# EAGLE design pic32mx170_tqfp44_breakout (EAGLE 7.2.0)
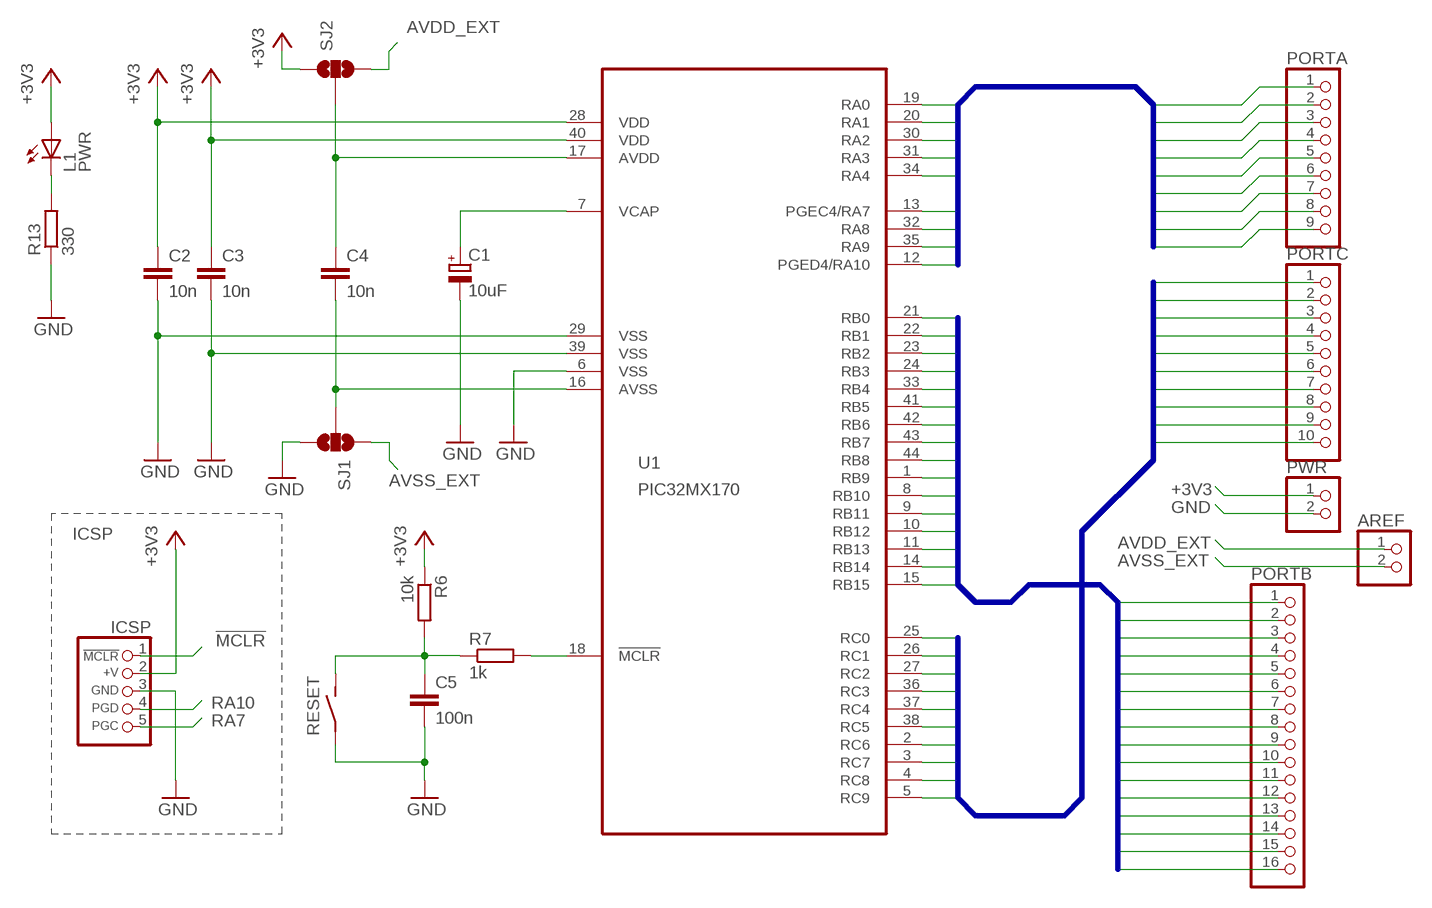
[diagram p0: schematic, sheet 1]

## Parts
AREF  PINHD-1X2  [1X02]
C1  10uF  CPOL-EUSMCA  [SMC_A]
C2  10n  C-EUC0805  [C0805]
C3  10n  C-EUC0805  [C0805]
C4  10n  C-EUC0805  [C0805]
C5  100n  C-EUC0805  [C0805]
ICSP  CON_HEADER_PRG_PIC_ICSPB  [HEADER_PRG_1X05_ICSP_B]
L1  PWR  LED-0805  [LED-805]
PORTA  PINHD-1X9  [1X09]
PORTB  PINHD-1X16  [1X16]
PORTC  PINHD-1X10  [1X10]
PWR  PINHD-1X2  [1X02]
R6  10k  R-EU_R0805  [R0805]
R7  1k  R-EU_R0805  [R0805]
R13  330  R-EU_R0805  [R0805]
RESET  ITT-PTS645S  [ITT-PTS645S]
SJ1  SOLDERJUMPER_2WAYS  [SJ_3]
SJ2  SOLDERJUMPER_2WAYS  [SJ_3]
U1  PIC32MX170  PIC32MX170FXXXD  [TQFP44]

## Nets
!MCLR: ICSP.1(/MCLR) R7.2 U1.18(!MCLR)
+3V3: C2.1 C3.1 ICSP.2(+V) L1.A PWR.1 R6.1 SJ2.1 U1.28(VDD) U1.40(VDD)
AVDD: C4.1 SJ2.2 U1.17(AVDD)
AVDD_EXT: AREF.1 SJ2.3
AVSS: C4.2 SJ1.2 U1.16(AVSS)
AVSS_EXT: AREF.2 SJ1.1
GND: C1.- C2.2 C3.2 C5.2 ICSP.3(GND) PWR.2 R13.1 RESET.P$1 RESET.P$2 SJ1.3 U1.6(VSS) U1.29(VSS) U1.39(VSS)
N$2: C1.+ U1.7(VCAP)
N$26: L1.C R13.2
RA0: PORTA.1 U1.19(RA0)
RA1: PORTA.2 U1.20(RA1)
RA2: PORTA.3 U1.30(RA2)
RA3: PORTA.4 U1.31(RA3)
RA4: PORTA.5 U1.34(RA4)
RA7: ICSP.5(PGC) PORTA.6 U1.13(PGEC4/RA7)
RA8: PORTA.7 U1.32(RA8)
RA9: PORTA.8 U1.35(RA9)
RA10: ICSP.4(PGD) PORTA.9 U1.12(PGED4/RA10)
RB0: PORTB.1 U1.21(RB0)
RB1: PORTB.2 U1.22(RB1)
RB2: PORTB.3 U1.23(RB2)
RB3: PORTB.4 U1.24(RB3)
RB4: PORTB.5 U1.33(RB4)
RB5: PORTB.6 U1.41(RB5)
RB6: PORTB.7 U1.42(RB6)
RB7: PORTB.8 U1.43(RB7)
RB8: PORTB.9 U1.44(RB8)
RB9: PORTB.10 U1.1(RB9)
RB10: PORTB.11 U1.8(RB10)
RB11: PORTB.12 U1.9(RB11)
RB12: PORTB.13 U1.10(RB12)
RB13: PORTB.14 U1.11(RB13)
RB14: PORTB.15 U1.14(RB14)
RB15: PORTB.16 U1.15(RB15)
RC0: PORTC.1 U1.25(RC0)
RC1: PORTC.2 U1.26(RC1)
RC2: PORTC.3 U1.27(RC2)
RC3: PORTC.4 U1.36(RC3)
RC4: PORTC.5 U1.37(RC4)
RC5: PORTC.6 U1.38(RC5)
RC6: PORTC.7 U1.2(RC6)
RC7: PORTC.8 U1.3(RC7)
RC8: PORTC.9 U1.4(RC8)
RC9: PORTC.10 U1.5(RC9)
RESET: C5.1 R6.2 R7.1 RESET.P$3 RESET.P$4

## Buses
RA[0..4],RA[7..10]
RB[0..15]
RC[0..9]

## Notes on the sheet
- ICSP

## Library data of the parts
AREF PWR = pinhead:PINHD-1X2: PIN HEADER
C1 = rcl:CPOL-EU: POLARIZED CAPACITOR, European symbol
C2-C5 = resistor:C-EU: CAPACITOR, European symbol
ICSP = dp_devices:CON_HEADER_PRG_PIC_ICSP: 5-pin PIC In Circuit Serial Programming header
L1 = dp_devices:LED: Light Emitting Diode
PORTA = pinhead:PINHD-1X9: PIN HEADER
PORTB = pinhead:PINHD-1X16: PIN HEADER
PORTC = pinhead:PINHD-1X10: PIN HEADER
R6 R7 = resistor:R-EU_: RESISTOR, European symbol
R13 = rcl:R-EU_: RESISTOR, European symbol
RESET = Catmacey:ITT-PTS645: ITT SWITCH
SJ1 SJ2 = SparkFun:SOLDERJUMPER_2WAY: Solder Jumper 2 way solder jumper
U1 = Catmacey:PIC32MX170FXXXD

## Board
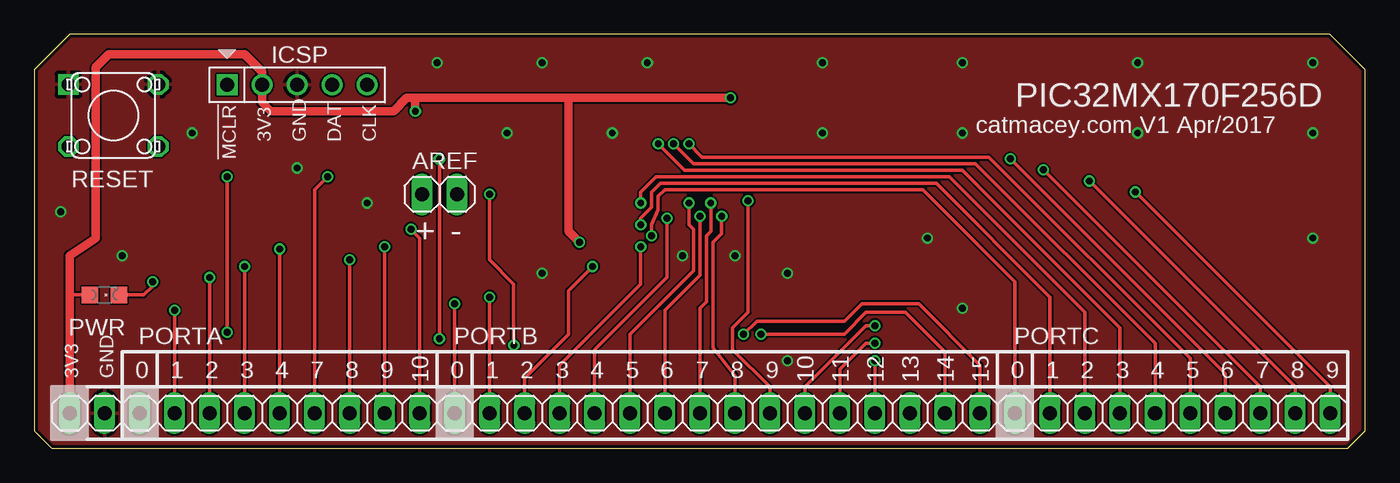
[diagram p1: board, top side]
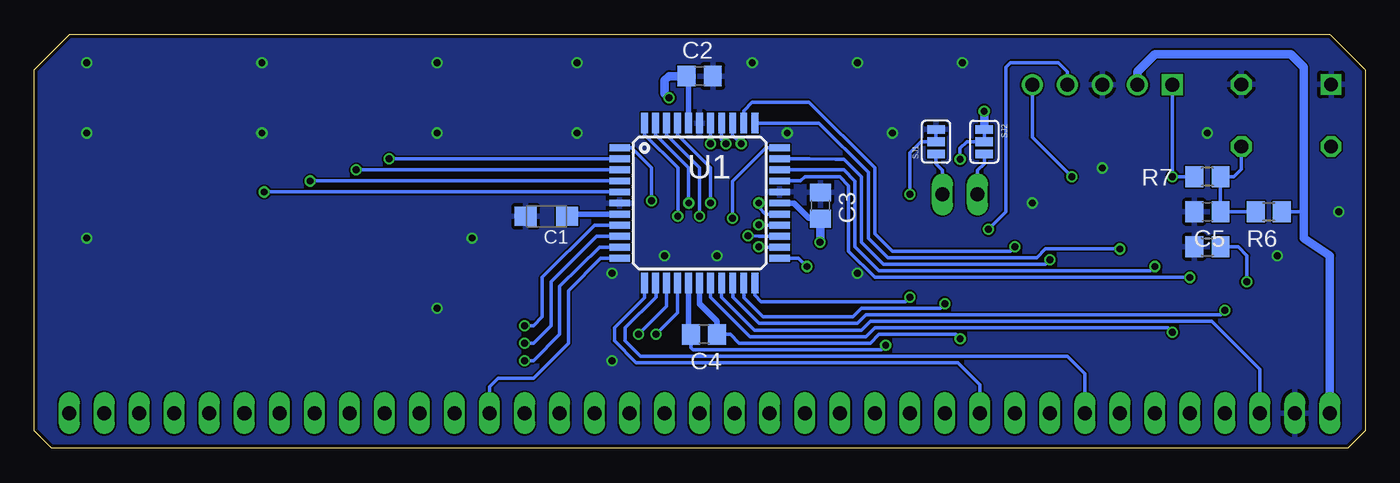
[diagram p2: board, bottom side, seen from below]

Size 96.51 x 30 mm. Coordinates in mm from the lower left corner, seen from the top.
Outline: 96.51,1.27 96.51,27.46 93.97,30 2.54,30 0,27.46 0,1.27 1.27,0 95.24,0 96.51,1.27
Copper layers (1*16): Top 0.035mm / dielectric 1.5mm / Bottom 0.035mm
Design rules "dirt_cheap_dirty_boards.v1": minimum track width 5mil, minimum drill 12mil, track to track 5mil, track to pad 5mil, pad to pad 5mil, via to via 5mil, smd to smd 0mil, copper to edge 10mil, drill to drill 10mil, minimum pad ring 10mil, minimum via ring 6mil, stop-mask expansion 2mil, vias tented up to drill 25mil, thermal gap 10mil

### Footprints (pad centres in the part's own frame; a part is rotated, then mirrored left to right if it is on the bottom)
1X02 = drill 1.016 long: 1 -1.27,0; 2 1.27,0
SMC_A = smd 1.6 x 1.4: + -1.5,0; - 1.5,0
C0805 = smd 1.3 x 1.5: 1 -0.95,0; 2 0.95,0
HEADER_PRG_1X05_ICSP_B = drill 1.016 square: 1 -5.08,0 | drill 1.016: 2 -2.54,0; 3 0,0; 4 2.54,0; 5 5.08,0
LED-805 = smd 1.2 x 1.2: A 0,-1.05; C 0,1.05
1X09 = drill 1.016 long: 1 -10.16,0; 2 -7.62,0; 3 -5.08,0; 4 -2.54,0; 5 0,0; 6 2.54,0; 7 5.08,0; 8 7.62,0; 9 10.16,0
1X16 = drill 1.016 long: 1 -19.05,0; 2 -16.51,0; 3 -13.97,0; 4 -11.43,0; 5 -8.89,0; 6 -6.35,0; 7 -3.81,0; 8 -1.27,0; 9 1.27,0; 10 3.81,0; 11 6.35,0; 12 8.89,0; 13 11.43,0; 14 13.97,0; 15 16.51,0; 16 19.05,0
1X10 = drill 1.016 long: 1 -11.43,0; 2 -8.89,0; 3 -6.35,0; 4 -3.81,0; 5 -1.27,0; 6 1.27,0; 7 3.81,0; 8 6.35,0; 9 8.89,0; 10 11.43,0
R0805 = smd 1.3 x 1.5: 1 -0.95,0; 2 0.95,0
ITT-PTS645S = drill 1 square: P$1 -3.25,2.25 | drill 1 octagon: P$2 3.25,2.25; P$3 -3.25,-2.25; P$4 3.25,-2.25
SJ_3 = smd 0.635 x 1.27: 1 -0.889,0; 2 0,0; 3 0.889,0
TQFP44 = smd 1.5 x 0.5: 1 -5.8,4; 2 -5.8,3.2; 3 -5.8,2.4; 4 -5.8,1.6; 5 -5.8,0.8; 6 -5.8,0; 7 -5.8,-0.8; 8 -5.8,-1.6; 9 -5.8,-2.4; 10 -5.8,-3.2; 11 -5.8,-4; 23 5.8,-4; 24 5.8,-3.2; 25 5.8,-2.4; 26 5.8,-1.6; 27 5.8,-0.8; 28 5.8,0; 29 5.8,0.8; 30 5.8,1.6; 31 5.8,2.4; 32 5.8,3.2; 33 5.8,4 | smd 0.5 x 1.5: 12 -4,-5.8; 13 -3.2,-5.8; 14 -2.4,-5.8; 15 -1.6,-5.8; 16 -0.8,-5.8; 17 0,-5.8; 18 0.8,-5.8; 19 1.6,-5.8; 20 2.4,-5.8; 21 3.2,-5.8; 22 4,-5.8; 34 4,5.8; 35 3.2,5.8; 36 2.4,5.8; 37 1.6,5.8; 38 0.8,5.8; 39 0,5.8; 40 -0.8,5.8; 41 -1.6,5.8; 42 -2.4,5.8; 43 -3.2,5.8; 44 -4,5.8

### Placement (x,y rotation side)
AREF  29.37,18.41 0 top
C1  59.37,16.83 180 bottom
C2  48.26,26.99 0 bottom
C3  39.5,17.59 90 bottom
C4  47.94,8.26 180 bottom
C5  11.43,17.14 180 bottom
ICSP  19.05,26.35 0 top
L1  5.08,11.11 270 top
PORTA  17.78,2.54 0 top
PORTB  49.53,2.54 0 top
PORTC  82.55,2.54 0 top
PWR  3.81,2.54 0 top
R6  6.99,17.14 180 bottom
R7  11.43,19.68 180 bottom
R13  11.43,14.61 0 bottom
RESET  5.71,24.13 0 top
SJ1  31.11,22.23 90 bottom
SJ2  27.62,22.23 270 bottom
U1  48.26,17.78 0 bottom

### Tracks (layer width: path | path; a pad name or v marks a point on that pad's centre or on a via)
!MCLR  (via drill 0.5)
  Top 0.254: v13.97,19.68 v13.97,8.41
  Bottom 0.254: U1.18 47.46,10.95 44.61,8.1 36.2,8.1 35.56,8.73 14.29,8.73 v13.97,8.41 | ICSP.1 v13.97,19.68 R7.2
+3V3  (via drill 0.5)
  Top 0.254: L1.A 2.54,11.11 2.54,10.79
  Top 0.61: 27.62,25.4 26.99,25.4 26.04,24.45 17.14,24.45 16.51,25.08 ICSP.2 16.51,27.3 15.24,28.57 5.4,28.57 4.45,27.62 4.45,15.24 2.54,13.97 2.54,10.79 PWR.1 | 27.62,25.4 38.73,25.4 | 38.73,25.4 v50.48,25.4 | v39.53,14.92 38.73,15.72 38.73,25.4 | v27.62,24.45 27.62,25.4
  Bottom 0.254: C2.1 49.06,26.84 | R6.1 4.45,17.14
  Bottom 0.406: 49.06,26.84 U1.40 | C3.1 39.53,16.67 40.32,16.67 41.43,17.78 U1.28
  Bottom 0.61: PWR.1 2.54,13.97 4.45,15.24 4.45,17.14 4.45,27.62 5.4,28.57 15.24,28.57 16.51,27.3 ICSP.2 | v50.48,25.4 50.8,25.72 50.8,26.67 50.48,26.99 C2.1 | v39.53,14.92 39.5,14.95 C3.1 | SJ2.1 v27.62,24.45
AVDD  (via drill 0.5)
  Top 0.254: v29.37,7.94 v29.37,20.95
  Bottom 0.254: C4.1 46.99,8.1 C4.1 46.04,8.26 45.4,7.62 35.88,7.62 35.24,8.26 29.69,8.26 v29.37,7.94 | v29.37,20.95 29.37,21.75 28.89,22.23 SJ2.2 27.62,22.86
  Bottom 0.406: U1.17 48.26,10.48 46.99,9.21 C4.1
AVDD_EXT
  Bottom 0.254: SJ2.3 27.62,20.64 28.1,20.16 AREF.1
AVSS  (via drill 0.5)
  Top 0.254: v34.77,7.46 34.77,11.91 33.02,13.65 v33.02,18.41
  Bottom 0.254: 49.06,8.88 C4.2 48.89,7.3 48.74,7.14 35.08,7.14 v34.77,7.46 | v33.02,18.41 33.02,21.43 32.23,22.23 SJ1.2 31.11,22.86
  Bottom 0.406: 49.06,8.88 49.05,9.36 49.05,10.16 U1.16
AVSS_EXT
  Bottom 0.254: SJ1.1 31.11,20.64 30.64,20.16 AREF.2
GND  (via drill 0.5)
  other vias: 64.77,15.24 46.99,13.97 57.15,22.86 67.31,22.86 80.01,22.86 1.9,17.14 19.05,20.32 11.43,22.86 34.29,22.86 29.21,27.94 36.83,27.94 44.45,27.94 24.13,17.78 36.83,12.7 41.91,22.86 54.61,6.35 92.71,22.86 92.71,27.94 92.71,15.24 80.01,27.94 67.31,27.94 57.15,27.94 50.8,13.97 54.61,12.7 67.31,10.16 6.35,13.97
  pour Bottom: -1.27,30.48 99.06,30.48 99.06,0 -1.27,0
  pour Top: -1.27,30.16 98.74,30.16 98.74,0 -1.27,0
N$2
  Bottom 0.254: C1.+ 57.72,16.98
  Bottom 0.406: 57.72,16.98 U1.7
N$26  (via drill 0.5)
  Top 0.254: L1.C 7.94,11.11 8.57,11.75 v8.57,12.06
  Bottom 0.254: v8.57,12.06 8.57,13.97 9.21,14.61 R13.2
RA0
  Bottom 0.254: U1.19 46.66,10.94 44.29,8.57 36.51,8.57 35.88,9.21 11.11,9.21 7.62,5.71 PORTA.1
RA1  (via drill 0.5)
  Top 0.254: PORTA.2 v10.16,10
  Bottom 0.254: U1.20 45.86,10.94 43.97,9.05 36.83,9.05 36.2,9.68 10.48,9.68 v10.16,10
RA2  (via drill 0.5)
  Top 0.254: PORTA.3 v12.7,12.38
  Bottom 0.254: v12.7,12.38 35.56,12.38 37.46,14.29 37.46,19.05 38.1,19.68 40.64,19.68 40.95,19.38 U1.30
RA3  (via drill 0.5)
  Top 0.254: PORTA.4 v15.24,13.18
  Bottom 0.254: v15.24,13.18 15.56,12.86 35.24,12.86 36.99,14.61 36.99,19.37 37.8,20.18 U1.31
RA4  (via drill 0.5)
  Top 0.254: PORTA.5 v17.78,14.45
  Bottom 0.254: v17.78,14.45 23.18,14.45 23.81,13.81 34.61,13.81 36.04,15.24 36.04,20 39.61,23.58 U1.34
RA7  (via drill 0.5)
  Top 0.254: v21.27,19.68 20.32,18.73 PORTA.6
  Bottom 0.254: U1.13 51.43,11.96 51.43,10.95 53.66,8.73 53.66,7.78 52.55,6.67 21.59,6.67 20.32,5.4 PORTA.6 | ICSP.5 24.13,22.54 v21.27,19.68
RA8  (via drill 0.5)
  Top 0.254: PORTA.7 v22.86,13.65
  Bottom 0.254: v22.86,13.65 23.18,13.34 34.92,13.34 36.51,14.92 36.51,19.68 37.78,20.95 38.42,20.95 40.3,20.98 U1.32
RA9  (via drill 0.5)
  Top 0.254: PORTA.8 v25.4,14.61
  Bottom 0.254: v25.4,14.61 25.72,14.29 34.29,14.29 35.56,15.56 35.56,20.32 40.32,25.08 44.45,25.08 45.06,24.47 U1.35
RA10  (via drill 0.5)
  Top 0.254: v27.3,15.88 27.94,15.24 PORTA.9
  Bottom 0.254: U1.12 52.26,10.92 54.45,8.73 54.45,7.78 52.86,6.19 29.53,6.19 27.94,4.6 PORTA.9 | ICSP.4 21.59,27.3 22.23,27.94 25.72,27.94 26.04,27.62 26.04,17.14 v27.3,15.88
RB0  (via drill 0.5)
  Top 0.254: PORTB.1 v30.48,10.48
  Bottom 0.254: v30.48,10.48 30.8,10.16 36.51,10.16 37.15,9.53 43.66,9.53 45.06,10.93 U1.21
RB1  (via drill 0.5)
  Top 0.254: PORTB.2 v33.02,10.95
  Bottom 0.254: v33.02,10.95 33.34,10.64 43.81,10.64 44.26,11.08 U1.22
RB2  (via drill 0.5)
  Top 0.254: PORTB.3 35.56,5.08 38.73,8.26 38.73,11.43 v40.48,13.18
  Bottom 0.254: v40.48,13.18 41.08,13.78 U1.23
RB3  (via drill 0.5)
  Top 0.254: PORTB.4 38.1,6.03 43.97,11.91 v43.97,14.61
  Bottom 0.254: v43.97,14.61 43.95,14.58 U1.24
RB4  (via drill 0.5)
  Top 0.254: PORTB.5 40.64,7.14 45.88,12.38 v45.88,16.67
  Bottom 0.254: U1.33 43.47,21.78 45.88,19.37 v45.88,16.67
RB5  (via drill 0.5)
  Top 0.254: v47.47,17.78 47.47,16.19 47.78,15.88 47.78,12.86 43.18,8.26 PORTB.6
  Bottom 0.254: U1.41 49.86,22.71 47.47,20.32 v47.47,17.78
RB6  (via drill 0.5)
  Top 0.254: v48.26,16.83 48.26,12.54 45.72,10 PORTB.7
  Bottom 0.254: U1.42 50.66,22.72 48.26,20.32 v48.26,16.83
RB7  (via drill 0.5)
  Top 0.254: v49.05,17.78 49.05,15.72 48.74,15.4 48.74,10.64 48.26,10.16 PORTB.8
  Bottom 0.254: U1.43 51.46,22.73 49.05,20.32 v49.05,17.78
RB8  (via drill 0.5)
  Top 0.254: v49.85,16.83 49.85,15.56 49.21,14.92 49.21,7.3 50.8,5.24 PORTB.9
  Bottom 0.254: U1.44 52.26,22.73 49.85,20.32 v49.85,16.83
RB9  (via drill 0.5)
  Top 0.254: PORTB.10 53.34,4.45 50.64,7.14 50.64,8.73 51.75,9.84 v51.75,17.94
  Bottom 0.254: v51.75,17.94 51.75,20.32 53.21,21.78 U1.1
RB10  (via drill 0.5)
  Top 0.254: PORTB.11 55.88,4.45 60.32,8.89 v60.96,8.89
  Bottom 0.254: v60.96,8.89 60.32,8.89 59.69,9.53 59.69,12.38 55.89,16.18 U1.8
RB11  (via drill 0.5)
  Top 0.254: PORTB.12 58.42,5.71 60.32,7.62 v60.96,7.62
  Bottom 0.254: v60.96,7.62 60.32,7.62 59.05,8.89 59.05,12.06 55.74,15.38 U1.9
RB12  (via drill 0.5)
  Top 0.254: PORTB.13 v60.96,6.35
  Bottom 0.254: v60.96,6.35 60.32,6.35 58.42,8.26 58.42,11.75 55.54,14.58 U1.10
RB13
  Bottom 0.254: PORTB.14 63.5,4.45 62.87,5.08 60.32,5.08 57.78,7.62 57.78,11.43 55.43,13.78 U1.11
RB14  (via drill 0.5)
  Top 0.254: PORTB.15 66.04,6.99 63.18,9.84 60.32,9.84 58.74,8.26 v52.7,8.26
  Bottom 0.254: v52.7,8.26 50.66,10.3 U1.14
RB15  (via drill 0.5)
  Top 0.254: PORTB.16 68.58,6.03 64.14,10.48 60.01,10.48 58.74,9.21 52.39,9.21 v51.43,8.26
  Bottom 0.254: v51.43,8.26 49.86,9.83 U1.15
RC0  (via drill 0.5)
  Top 0.254: v44.77,15.4 44.77,16.19 45.24,17.3 45.24,18.26 45.72,18.73 64.45,18.73 71.12,12.06 PORTC.1
  Bottom 0.254: v44.77,15.4 43.95,15.38 U1.25
RC1  (via drill 0.5)
  Top 0.254: v43.97,16.19 43.97,16.67 44.77,17.46 44.77,18.57 45.4,19.21 65.41,19.21 73.66,10.95 PORTC.2
  Bottom 0.254: v43.97,16.19 v43.96,16.18 U1.26
RC2  (via drill 0.5)
  Top 0.254: v43.97,17.78 43.97,18.57 45.08,19.68 66.36,19.68 76.2,9.84 PORTC.3
  Bottom 0.254: v43.97,17.78 43.97,17.46 43.49,16.98 U1.27
RC3  (via drill 0.5)
  Top 0.254: v45.24,22.07 47.15,20.16 67.31,20.16 78.74,8.73 PORTC.4
  Bottom 0.254: U1.36 45.88,23.56 45.88,22.7 v45.24,22.07
RC4  (via drill 0.5)
  Top 0.254: v46.35,22.07 47.78,20.64 68.26,20.64 81.28,7.62 PORTC.5
  Bottom 0.254: U1.37 46.67,23.57 46.67,22.38 v46.35,22.07
RC5  (via drill 0.5)
  Top 0.254: v47.47,22.07 48.42,21.11 69.22,21.11 83.82,6.51 PORTC.6
  Bottom 0.254: U1.38 v47.47,22.07
RC6  (via drill 0.5)
  Top 0.254: PORTC.7 86.36,5.4 v70.78,20.98
  Bottom 0.254: v70.78,20.98 U1.2
RC7  (via drill 0.5)
  Top 0.254: v73.17,20.18 88.9,4.45 PORTC.8
  Bottom 0.254: v73.17,20.18 U1.3
RC8  (via drill 0.5)
  Top 0.254: PORTC.9 91.44,4.45 v76.51,19.38
  Bottom 0.254: v76.51,19.38 U1.4
RC9  (via drill 0.5)
  Top 0.254: v79.84,18.58 93.98,4.45 PORTC.10
  Bottom 0.254: v79.84,18.58 U1.5
RESET  (1 unrouted)
  Bottom 0.254: R6.2 C5.1 R7.1 9.53,19.68 8.96,20.25 RESET.P$4

### Text on the board
tNames: PIC32MX170F256D | catmacey.com V1 Apr/2017 | 3V3 | GND | DAT | CLK | !MCLR | + | - | 3V3 | GND | 0 | 1 | 2 | 3 | 4 | 7 | 8 | 9 | 10 | 0 | 1 | 2 | 3 | 4 | 5 | 6 | 7 | 8 | 9 | 10 | 11 | 12 | 13 | 14 | 15 | 0 | 1 | 2 | 3 | 4 | 5 | 6 | 7 | 8 | 9